# EAGLE design Baseline_Shield (EAGLE 7.2.0)
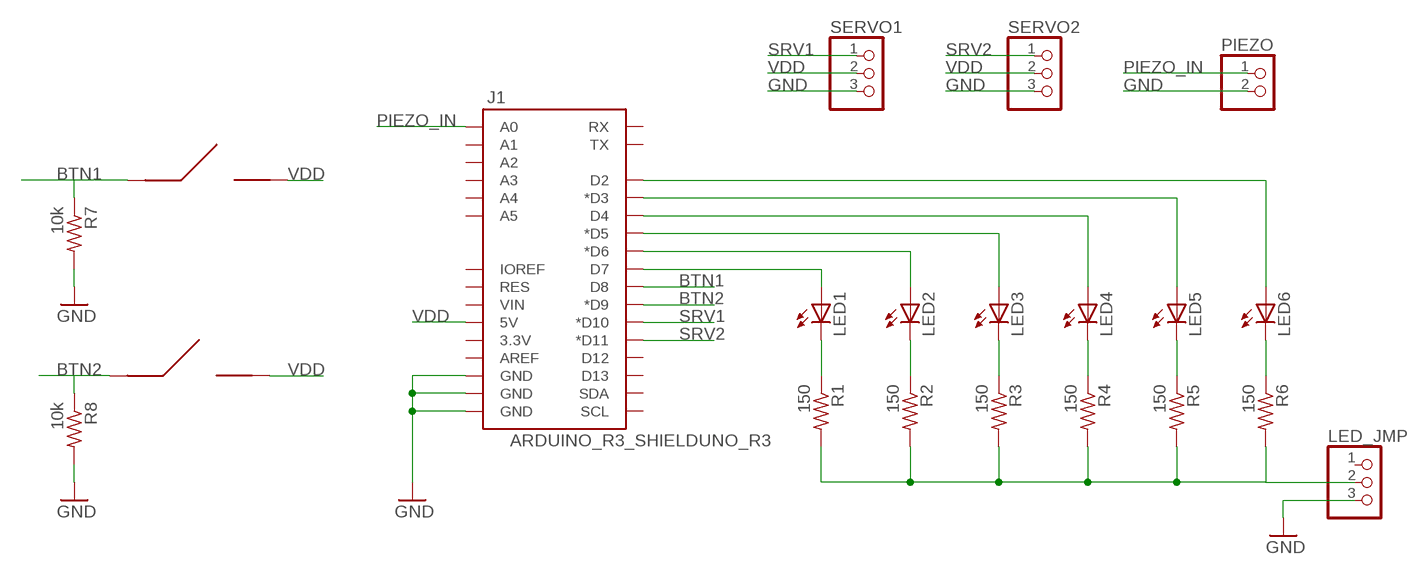
[diagram p0: schematic, sheet 1]

## Parts
J1  ARDUINO_R3_SHIELDUNO_R3  ARDUINO_R3_SHIELD  [UNO_R3_SHIELD]
LED1  LEDCHIPLED_1206  [CHIPLED_1206]
LED2  LEDCHIPLED_1206  [CHIPLED_1206]
LED3  LEDCHIPLED_1206  [CHIPLED_1206]
LED4  LEDCHIPLED_1206  [CHIPLED_1206]
LED5  LEDCHIPLED_1206  [CHIPLED_1206]
LED6  LEDCHIPLED_1206  [CHIPLED_1206]
LED_JMP  PINHD-1X3  [1X03]
PIEZO  PINHD-1X2  [1X02]
R1  150  R-US_R1206  [R1206]
R2  150  R-US_R1206  [R1206]
R3  150  R-US_R1206  [R1206]
R4  150  R-US_R1206  [R1206]
R5  150  R-US_R1206  [R1206]
R6  150  R-US_R1206  [R1206]
R7  10k  R-US_R1206  [R1206]
R8  10k  R-US_R1206  [R1206]
SERVO1  PINHD-1X3  [1X03]
SERVO2  PINHD-1X3  [1X03]
U$1  IEEE_LOGO_BUTTON  [IEEE_LOGO_BUTTON]
U$2  IEEE_LOGO_BUTTON  [IEEE_LOGO_BUTTON]

## Nets
BTN1: J1.D8 R7.1 U$2.P$1
BTN2: J1.D9(*D9) R8.1 U$1.P$1
GND: J1.GND@0(GND) J1.GND@1(GND) J1.GND@2(GND) LED_JMP.3 PIEZO.2 R7.2 R8.2 SERVO1.3 SERVO2.3
N$1: J1.D2 LED6.A
N$2: J1.D3(*D3) LED5.A
N$3: J1.D4 LED4.A
N$4: J1.D5(*D5) LED3.A
N$5: J1.D6(*D6) LED2.A
N$6: J1.D7 LED1.A
N$7: LED1.C R1.1
N$8: LED2.C R2.1
N$9: LED3.C R3.1
N$10: LED4.C R4.1
N$11: LED5.C R5.1
N$12: LED6.C R6.1
N$13: LED_JMP.2 R1.2 R2.2 R3.2 R4.2 R5.2 R6.2
PIEZO_IN: J1.A0 PIEZO.1
SRV1: J1.D10(*D10) SERVO1.1
SRV2: J1.D11(*D11) SERVO2.1
VDD: J1.5V SERVO1.2 SERVO2.2 U$1.P$2 U$2.P$2
Unconnected: J1.3.3V J1.A1 J1.A2 J1.A3 J1.A4 J1.A5 J1.AREF J1.D12 J1.D13 J1.IOREF J1.RES J1.RX J1.SCL J1.SDA J1.TX J1.VIN LED_JMP.1

## Library data of the parts
J1 = Workshop_Library:ARDUINO_R3_SHIELD: Shield form compatible with the Arduino Uno R3.
LED1-LED6 = led:LED: LED OSRAM: - CHIPLED LG R971, LG N971, LY N971, LG Q971, LY Q971, LO R971, LY R971 LH N974, LH R974 LS Q976, LO Q976, LY Q976 LO Q996 - Hyper CHIPLED LW Q18S LB Q993, LB Q99A, LB R99A - SideLED LS A670, LO A670, LY A670, LG A670, LP A670 LB A673, LV A673, LT A673, LW A673 LH A674 LY A675 LS A676, LA A676, LO A676, LY A676, LW A676 LS A679, LY A679, LG A679 - Hyper Micro SIDELED® LS Y876, LA Y876, LO Y876, LY Y876 LT Y87S - SmartLED LW L88C, LW L88S LB L89C, LB L89S, LG L890 LS L89K, LO L89K, LY L89K LS L896, LA L896, LO L896, LY L896 - TOPLED LS T670, LO T670, LY T670, LG T670, LP T670 LSG T670, LSP T670, LSY T670, LOP T670, LYG T670 LG T671, LOG T671, LSG T671 LB T673, LV T673, LT T673, LW T673 LH T674 LS T676, LA T676, LO T676, LY T676, LB T676, LH T676, LSB T676, LW T676 LB T67C, LV T67C, LT T67C, LS T67K, LO T67K, LY T67K, LW E67C LS E67B, LA E67B, LO E67B, LY E67B, LB E67C, LV E67C, LT E67C LW T67C LS T679, LY T679, LG T679 LS T770, LO T770, LY T770, LG T770, LP T770 LB T773, LV T773, LT T773, LW T773 LH T774 LS E675, LA E675, LY E675, LS T675 LS T776, LA T776, LO T776, LY T776, LB T776 LHGB T686 LT T68C, LB T68C - Hyper Mini TOPLED® LB M676 - Mini TOPLED Santana® LG M470 LS M47K, LO M47K, LY M47K Source: http://www.osram.convergy.de LUXEON: - LUMILED® LXK2-PW12-R00, LXK2-PW12-S00, LXK2-PW14-U00, LXK2-PW14-V00 LXK2-PM12-R00, LXK2-PM12-S00, LXK2-PM14-U00 LXK2-PE12-Q00, LXK2-PE12-R00, LXK2-PE12-S00, LXK2-PE14-T00, LXK2-PE14-U00 LXK2-PB12-K00, LXK2-PB12-L00, LXK2-PB12-M00, LXK2-PB14-N00, LXK2-PB14-P00, LXK2-PB14-Q00 LXK2-PR12-L00, LXK2-PR12-M00, LXK2-PR14-Q00, LXK2-PR14-R00 LXK2-PD12-Q00, LXK2-PD12-R00, LXK2-PD12-S00 LXK2-PH12-R00, LXK2-PH12-S00 LXK2-PL12-P00, LXK2-PL12-Q00, LXK2-PL12-R00 Source: www.luxeon.com KINGBRIGHT: KA-3528ASYC Source: www.kingbright.com
LED_JMP SERVO1 SERVO2 = pinhead:PINHD-1X3: PIN HEADER
PIEZO = pinhead:PINHD-1X2: PIN HEADER
R1-R8 = rcl:R-US_: RESISTOR, American symbol
U$1 U$2 = Workshop_Library:IEEE_LOGO_BUTTON

## Board
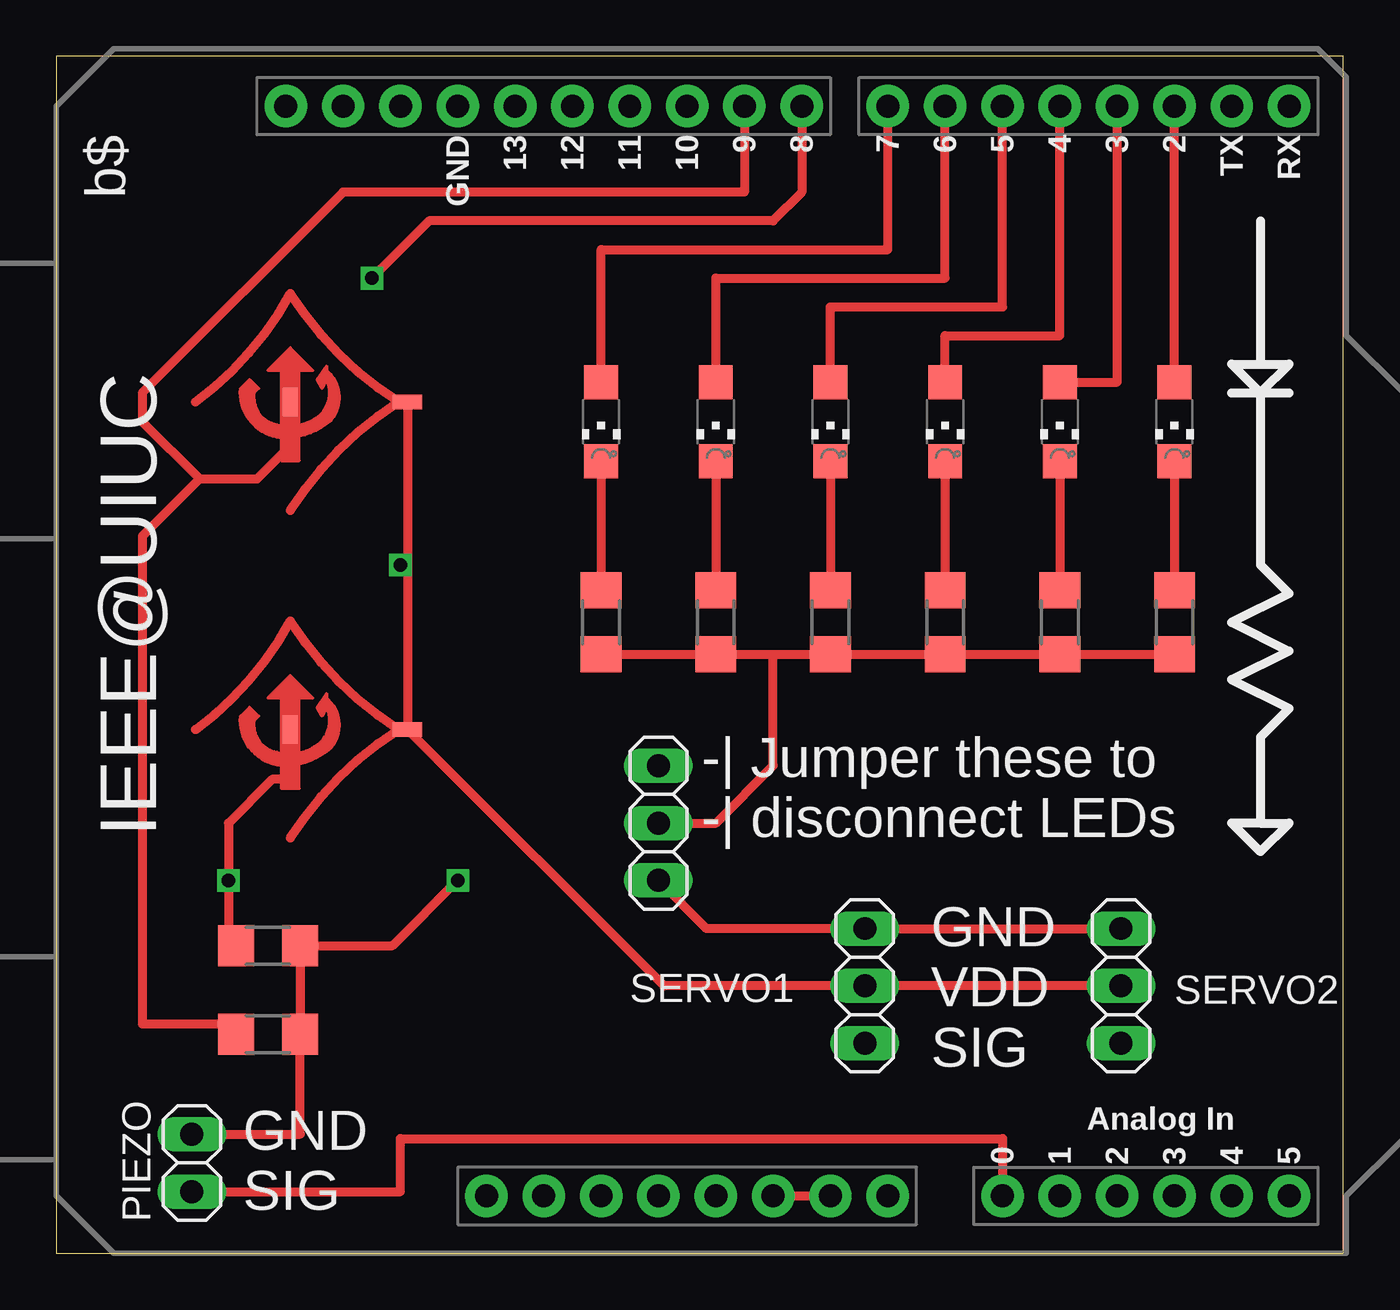
[diagram p1: board, top side]
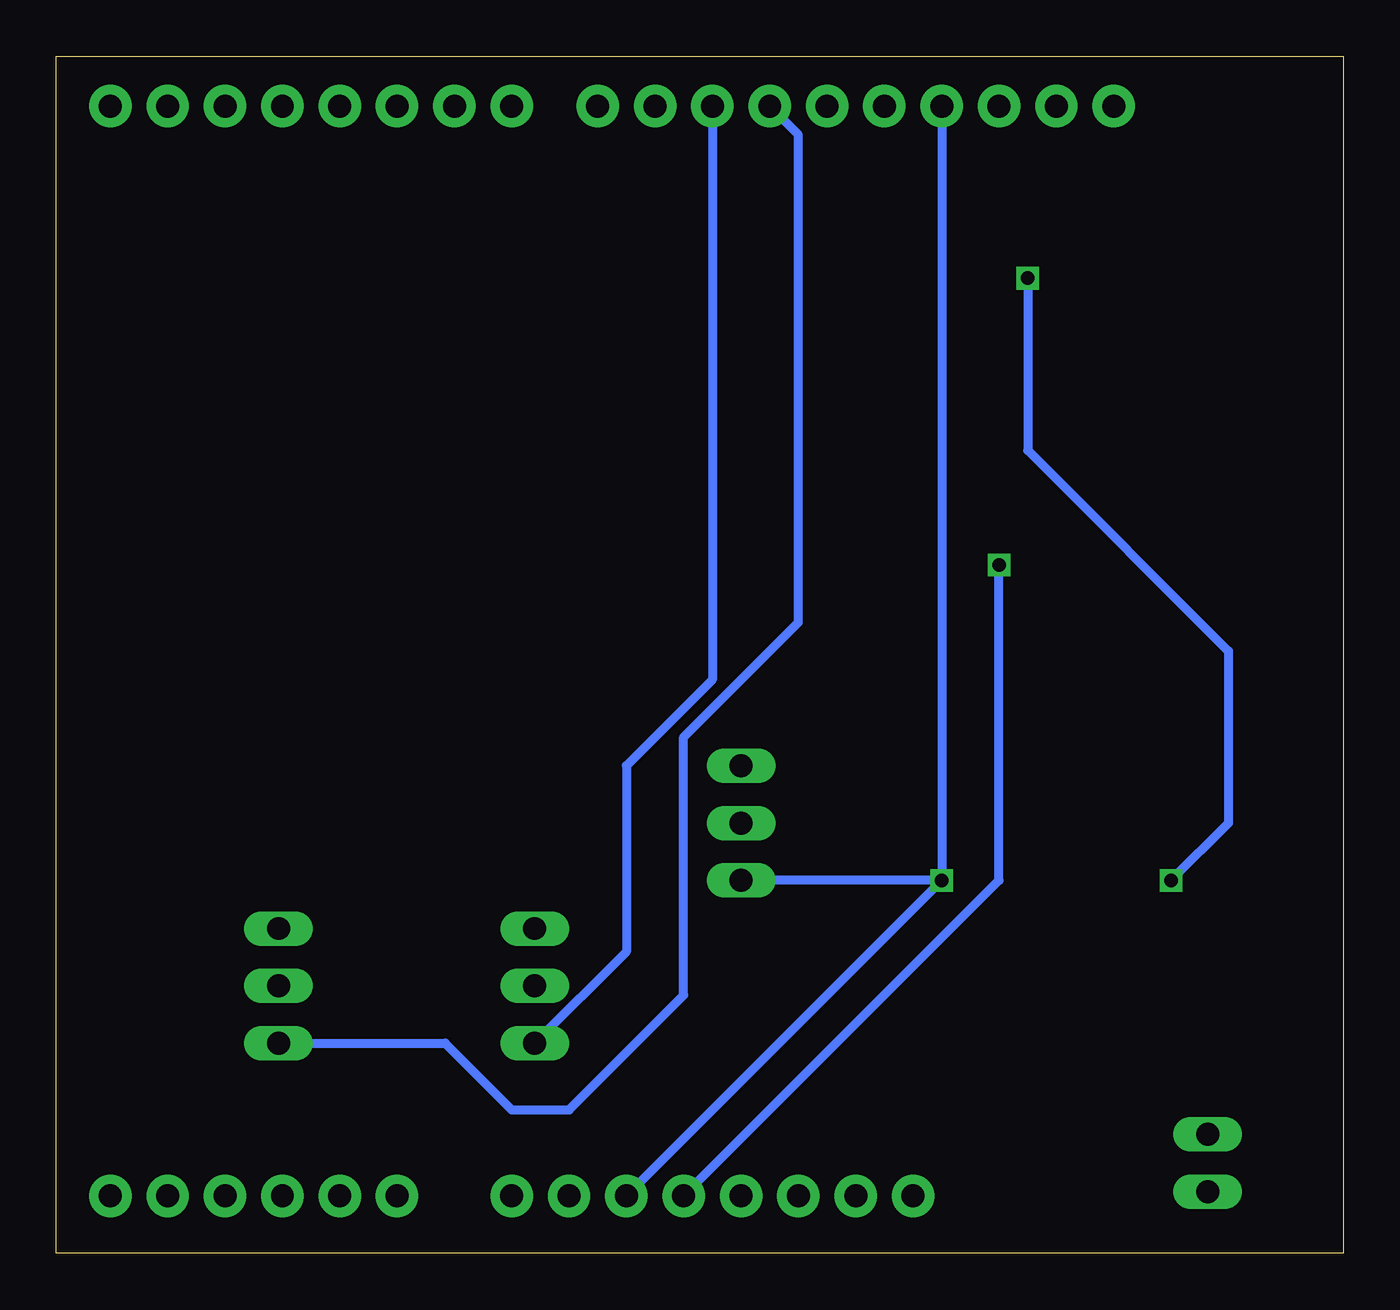
[diagram p2: board, bottom side, seen from below]

Size 57 x 53 mm. Coordinates in mm from the lower left corner, seen from the top.
Outline: 0,0 57,0 57,53 0,53 0,0
Copper layers (1*16): Top 0.035mm / dielectric 1.5mm / Bottom 0.035mm
Design rules "default": minimum track width 10mil, minimum drill 24mil, track to track 8mil, track to pad 8mil, pad to pad 8mil, via to via 8mil, smd to smd 8mil, copper to edge 40mil, drill to drill 8mil, minimum pad ring 10mil, minimum via ring 8mil, stop-mask expansion 4mil, vias tented up to drill 0mil, thermal gap 10mil

### Footprints (pad centres in the part's own frame; a part is rotated, then mirrored left to right if it is on the bottom)
UNO_R3_SHIELD = drill 1.016 pad 1.88: 3.3V 50.8,26.67; 5V 50.8,29.21; A0 50.8,41.91; A1 50.8,44.45; A2 50.8,46.99; A3 50.8,49.53; A4 50.8,52.07; A5 50.8,54.61; AREF 2.54,15.24; D2 2.54,49.53; D3 2.54,46.99; D4 2.54,44.45; D5 2.54,41.91; D6 2.54,39.37; D7 2.54,36.83; D8 2.54,33.02; D9 2.54,30.48; D10 2.54,27.94; D11 2.54,25.4; D12 2.54,22.86; D13 2.54,20.32; GND@0 50.8,31.75; GND@1 50.8,34.29; GND@2 2.54,17.78; IOREF 50.8,21.59; NC 50.8,19.05; RES 50.8,24.13; RX 2.54,54.61; SCL 2.54,10.16; SDA 2.54,12.7; TX 2.54,52.07; VIN 50.8,36.83
CHIPLED_1206 = smd 1.5 x 1.5: A 0,-1.75; C 0,1.75
1X03 = drill 1.016 long: 1 -2.54,0; 2 0,0; 3 2.54,0
1X02 = drill 1.016 long: 1 -1.27,0; 2 1.27,0
R1206 = smd 1.6 x 1.803: 1 -1.422,0; 2 1.422,0
IEEE_LOGO_BUTTON = smd 0.635 x 1.27: P$1 0.2,-0.4 | smd 1.27 x 0.635: P$2 5.4,-0.4

### Placement (x,y rotation side)
J1  0,53.34 270 top
LED1  24.13,36.83 180 top
LED2  29.21,36.83 180 top
LED3  34.29,36.83 180 top
LED4  39.37,36.83 180 top
LED5  44.45,36.83 180 top
LED6  49.53,36.83 180 top
LED_JMP  26.67,19.05 270 top
PIEZO  6,4 90 top
R1  24.13,27.94 270 top
R2  29.21,27.94 270 top
R3  34.29,27.94 270 top
R4  39.37,27.94 270 top
R5  44.45,27.94 270 top
R6  49.53,27.94 270 top
R7  9.38,13.62 0 top
R8  9.38,9.7 0 top
SERVO1  35.81,11.84 90 top
SERVO2  47.16,11.84 90 top
U$1  10.16,38.1 0 top
U$2  10.16,23.59 0 top

### Tracks (layer width: path | path; a pad name or v marks a point on that pad's centre or on a via)
BTN1  (via drill 0.6)
  Top 0.406: U$2.P$1 10.16,20.99 9.56,20.99 7.62,19.05 v7.62,16.51 7.62,13.96 R7.1 | J1.D8 33.02,46.99 31.75,45.72 16.51,45.72 v13.97,43.18
  Bottom 0.406: v13.97,43.18 13.97,35.56 5.08,26.67 5.08,19.05 v7.62,16.51
BTN2
  Top 0.406: J1.D9 30.48,46.99 12.7,46.99 3.81,38.1 3.81,36.83 6.35,34.29 | 6.35,34.29 3.81,31.75 3.81,10.16 7.96,10.16 R8.1 | 6.35,34.29 8.89,34.29 10.16,35.56 10.16,37.5 U$1.P$1
GND  (via drill 0.6)
  Top 0.406: J1.GND@0 J1.GND@1 | PIEZO.2 10.8,5.27 R8.2 R7.2 14.89,13.62 v17.78,16.51 | SERVO2.3 SERVO1.3 28.8,14.38 LED_JMP.3
  Bottom 0.406: J1.GND@2 v17.78,16.51 | v17.78,16.51 J1.GND@0 | v17.78,16.51 LED_JMP.3
N$1
  Top 0.406: LED6.A J1.D2
N$2
  Top 0.406: LED5.A 46.99,38.58 J1.D3
N$3
  Top 0.406: LED4.A 39.37,40.64 44.45,40.64 J1.D4
N$4
  Top 0.406: LED3.A 34.29,41.91 41.91,41.91 J1.D5
N$5
  Top 0.406: LED2.A 29.21,43.18 39.37,43.18 J1.D6
N$6
  Top 0.406: LED1.A 24.13,44.45 36.83,44.45 J1.D7
N$7
  Top 0.406: LED1.C R1.1
N$8
  Top 0.406: LED2.C R2.1
N$9
  Top 0.406: LED3.C R3.1
N$10
  Top 0.406: LED4.C R4.1
N$11
  Top 0.406: LED5.C R5.1
N$12
  Top 0.406: LED6.C R6.1
N$13
  Top 0.406: R1.2 R2.2 31.75,26.52 | 31.75,26.52 R3.2 R4.2 R5.2 49.38,26.52 49.53,26.67 R6.2 | LED_JMP.2 29.21,19.05 31.75,21.59 31.75,26.52
PIEZO_IN
  Top 0.406: PIEZO.1 15.24,2.73 15.24,5.08 41.91,5.08 J1.A0
SRV1
  Bottom 0.406: J1.D10 27.94,25.4 31.75,21.59 31.75,13.36 SERVO1.1
SRV2
  Bottom 0.406: SERVO2.1 39.78,9.3 36.83,6.35 34.29,6.35 29.21,11.43 29.21,22.86 24.13,27.94 24.13,49.53 J1.D11
VDD  (via drill 0.6)
  Top 0.406: U$1.P$2 15.56,30.48 | 15.56,30.48 U$2.P$2 26.91,11.84 SERVO1.2 SERVO2.2 | v15.24,30.48 15.56,30.48
  Bottom 0.406: J1.5V 15.24,16.51 v15.24,30.48

### Text on the board
tNames: b$ | IEEE@UIUC | -| Jumper these to / -| disconnect LEDs | GND / VDD / SIG | GND / SIG